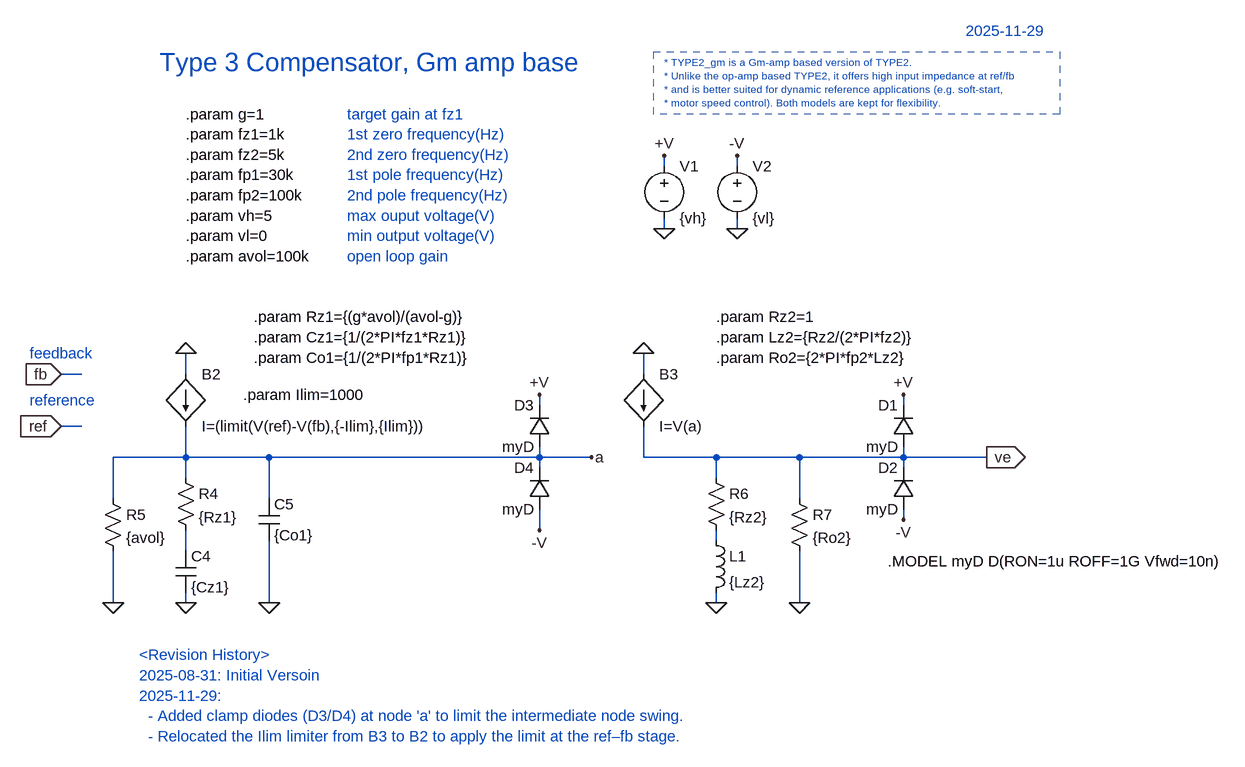
[diagram p0: schematic TYPE3_gm.asc]
TYPE3_gm.asc, the LTspice schematic file:
Version 4.1
SHEET 1 2344 1140
WIRE 512 -208 512 -224
WIRE 624 -208 624 -224
WIRE 512 -112 512 -128
WIRE 624 -112 624 -128
WIRE -384 112 -416 112
WIRE -224 112 -224 80
WIRE 480 112 480 80
WIRE 320 160 320 144
WIRE 880 160 880 144
WIRE -384 192 -416 192
WIRE -224 240 -224 192
WIRE -224 240 -336 240
WIRE -96 240 -224 240
WIRE 320 240 320 224
WIRE 320 240 -96 240
WIRE 400 240 320 240
WIRE 480 240 480 192
WIRE 592 240 480 240
WIRE 720 240 592 240
WIRE 880 240 880 224
WIRE 880 240 720 240
WIRE 1008 240 880 240
WIRE 320 256 320 240
WIRE 880 256 880 240
WIRE -224 272 -224 240
WIRE 592 272 592 240
WIRE -336 304 -336 240
WIRE -96 304 -96 240
WIRE 720 304 720 240
WIRE 880 336 880 320
WIRE 320 352 320 320
WIRE 592 368 592 352
WIRE -224 384 -224 352
WIRE -336 464 -336 384
WIRE -224 464 -224 448
WIRE -96 464 -96 368
WIRE 592 464 592 448
WIRE 720 464 720 384
FLAG 624 -112 0
FLAG 512 -112 0
FLAG 512 -224 +V
FLAG 624 -224 -V
FLAG -224 464 0
FLAG -224 80 0
FLAG -336 464 0
FLAG -96 464 0
FLAG 592 464 0
FLAG 720 464 0
FLAG 480 80 0
FLAG 400 240 a
FLAG 880 336 -V
FLAG 880 144 +V
FLAG 1008 240 ve
IOPIN 1008 240 Out
FLAG -416 112 fb
IOPIN -416 112 In
FLAG -416 192 ref
IOPIN -416 192 In
FLAG 320 144 +V
FLAG 320 352 -V
SYMBOL voltage 512 -224 R0
SYMATTR InstName V1
SYMATTR Value {vh}
SYMBOL voltage 624 -224 R0
SYMATTR InstName V2
SYMATTR Value {vl}
SYMBOL bi -224 112 R0
SYMATTR InstName B2
SYMATTR Value I=(limit(V(ref)-V(fb),{-Ilim},{Ilim}))
SYMBOL res -240 256 R0
SYMATTR InstName R4
SYMATTR Value {Rz1}
SYMBOL cap -240 384 R0
SYMATTR InstName C4
SYMATTR Value {Cz1}
SYMBOL res -352 288 R0
SYMATTR InstName R5
SYMATTR Value {avol}
SYMBOL cap -112 304 R0
SYMATTR InstName C5
SYMATTR Value {Co1}
SYMBOL res 576 256 R0
SYMATTR InstName R6
SYMATTR Value {Rz2}
SYMBOL res 704 288 R0
SYMATTR InstName R7
SYMATTR Value {Ro2}
SYMBOL ind 576 352 R0
SYMATTR InstName L1
SYMATTR Value {Lz2}
SYMBOL bi 480 112 R0
SYMATTR InstName B3
SYMATTR Value I=V(a)
SYMBOL diode 896 224 R180
WINDOW 0 24 64 Left 2
WINDOW 3 24 0 Left 2
SYMATTR InstName D1
SYMATTR Value myD
SYMBOL diode 896 320 R180
WINDOW 0 24 64 Left 2
WINDOW 3 24 0 Left 2
SYMATTR InstName D2
SYMATTR Value myD
SYMBOL diode 336 224 R180
WINDOW 0 24 64 Left 2
WINDOW 3 24 0 Left 2
SYMATTR InstName D3
SYMATTR Value myD
SYMBOL diode 336 320 R180
WINDOW 0 24 64 Left 2
WINDOW 3 24 0 Left 2
SYMATTR InstName D4
SYMATTR Value myD
TEXT -224 -288 Left 2 !.param g=1\n.param fz1=1k\n.param fz2=5k\n.param fp1=30k\n.param fp2=100k\n.param vh=5\n.param vl=0\n.param avol=100k
TEXT -264 -368 Left 4 ;Type 3 Compensator, Gm amp base
TEXT 24 -288 Left 2 ;target gain at fz1\n1st zero frequency(Hz)\n2nd zero frequency(Hz)\n1st pole frequency(Hz)\n2nd pole frequency(Hz)\nmax ouput voltage(V)\nmin output voltage(V)\nopen loop gain
TEXT 976 -416 Left 2 ;2025-11-29
TEXT -120 24 Left 2 !.param Rz1={(g*avol)/(avol-g)}\n.param Cz1={1/(2*PI*fz1*Rz1)}\n.param Co1={1/(2*PI*fp1*Rz1)}
TEXT 592 24 Left 2 !.param Rz2=1\n.param Lz2={Rz2/(2*PI*fz2)}\n.param Ro2={2*PI*fp2*Lz2}
TEXT 856 400 Left 2 !.MODEL myD D(RON=1u ROFF=1G Vfwd=10n)
TEXT -136 144 Left 2 !.param Ilim=1000
TEXT -464 80 Left 2 ;feedback
TEXT -464 152 Left 2 ;reference
TEXT 512 -368 Left 1 ;* TYPE2_gm is a Gm-amp based version of TYPE2.\n* Unlike the op-amp based TYPE2, it offers high input impedance at ref/fb\n* and is better suited for dynamic reference applications (e.g. soft-start,\n* motor speed control). Both models are kept for flexibility.
TEXT -296 544 Left 2 ;<Revision History>\n2025-08-31: Initial Versoin\n2025-11-29: \n  - Added clamp diodes (D3/D4) at node 'a' to limit the intermediate node swing.\n  - Relocated the Ilim limiter from B3 to B2 to apply the limit at the ref–fb stage.
RECTANGLE Normal 1120 -288 496 -384 2

The netlist it stands for:
* TYPE3_gm.asc
V1 +V 0 {vh}
V2 -V 0 {vl}
B2 0 a I=(limit(V(ref)-V(fb),{-Ilim},{Ilim}))
R4 a N002 {Rz1}
C4 N002 0 {Cz1}
R5 a 0 {avol}
C5 a 0 {Co1}
R6 ve N001 {Rz2}
R7 ve 0 {Ro2}
L1 N001 0 {Lz2}
B3 0 ve I=V(a)
D1 ve +V myD
D2 -V ve myD
D3 a +V myD
D4 -V a myD
.model D D
.lib standard.dio
.param g=1
.param fz1=1k
.param fz2=5k
.param fp1=30k
.param fp2=100k
.param vh=5
.param vl=0
.param avol=100k
* Type 3 Compensator, Gm amp base
* target gain at fz1
* 1st zero frequency(Hz)
* 2nd zero frequency(Hz)
* 1st pole frequency(Hz)
* 2nd pole frequency(Hz)
* max ouput voltage(V)
* min output voltage(V)
* open loop gain
* 2025-11-29
.param Rz1={(g*avol)/(avol-g)}
.param Cz1={1/(2*PI*fz1*Rz1)}
.param Co1={1/(2*PI*fp1*Rz1)}
.param Rz2=1
.param Lz2={Rz2/(2*PI*fz2)}
.param Ro2={2*PI*fp2*Lz2}
.MODEL myD D(RON=1u ROFF=1G Vfwd=10n)
.param Ilim=1000
* feedback
* reference
* * TYPE2_gm is a Gm-amp based version of TYPE2.
* * Unlike the op-amp based TYPE2, it offers high input impedance at ref/fb
* * and is better suited for dynamic reference applications (e.g. soft-start,
* * motor speed control). Both models are kept for flexibility.
* <Revision History>
* 2025-08-31: Initial Versoin
* 2025-11-29:
*   - Added clamp diodes (D3/D4) at node 'a' to limit the intermediate node swing.
*   - Relocated the Ilim limiter from B3 to B2 to apply the limit at the ref–fb stage.
.backanno
.end